# EasyEDA Pro project ir2104_V1.2.eprj

# Schematic IR2104
Create Date: 2023-09-25; Page Name: P1; Project Name: 主控板_V1; Schematic Name: Schematic1; Update Date: 2023-09-26; Company: 嘉立创EDA; Page Size: A4; Version: V1.0
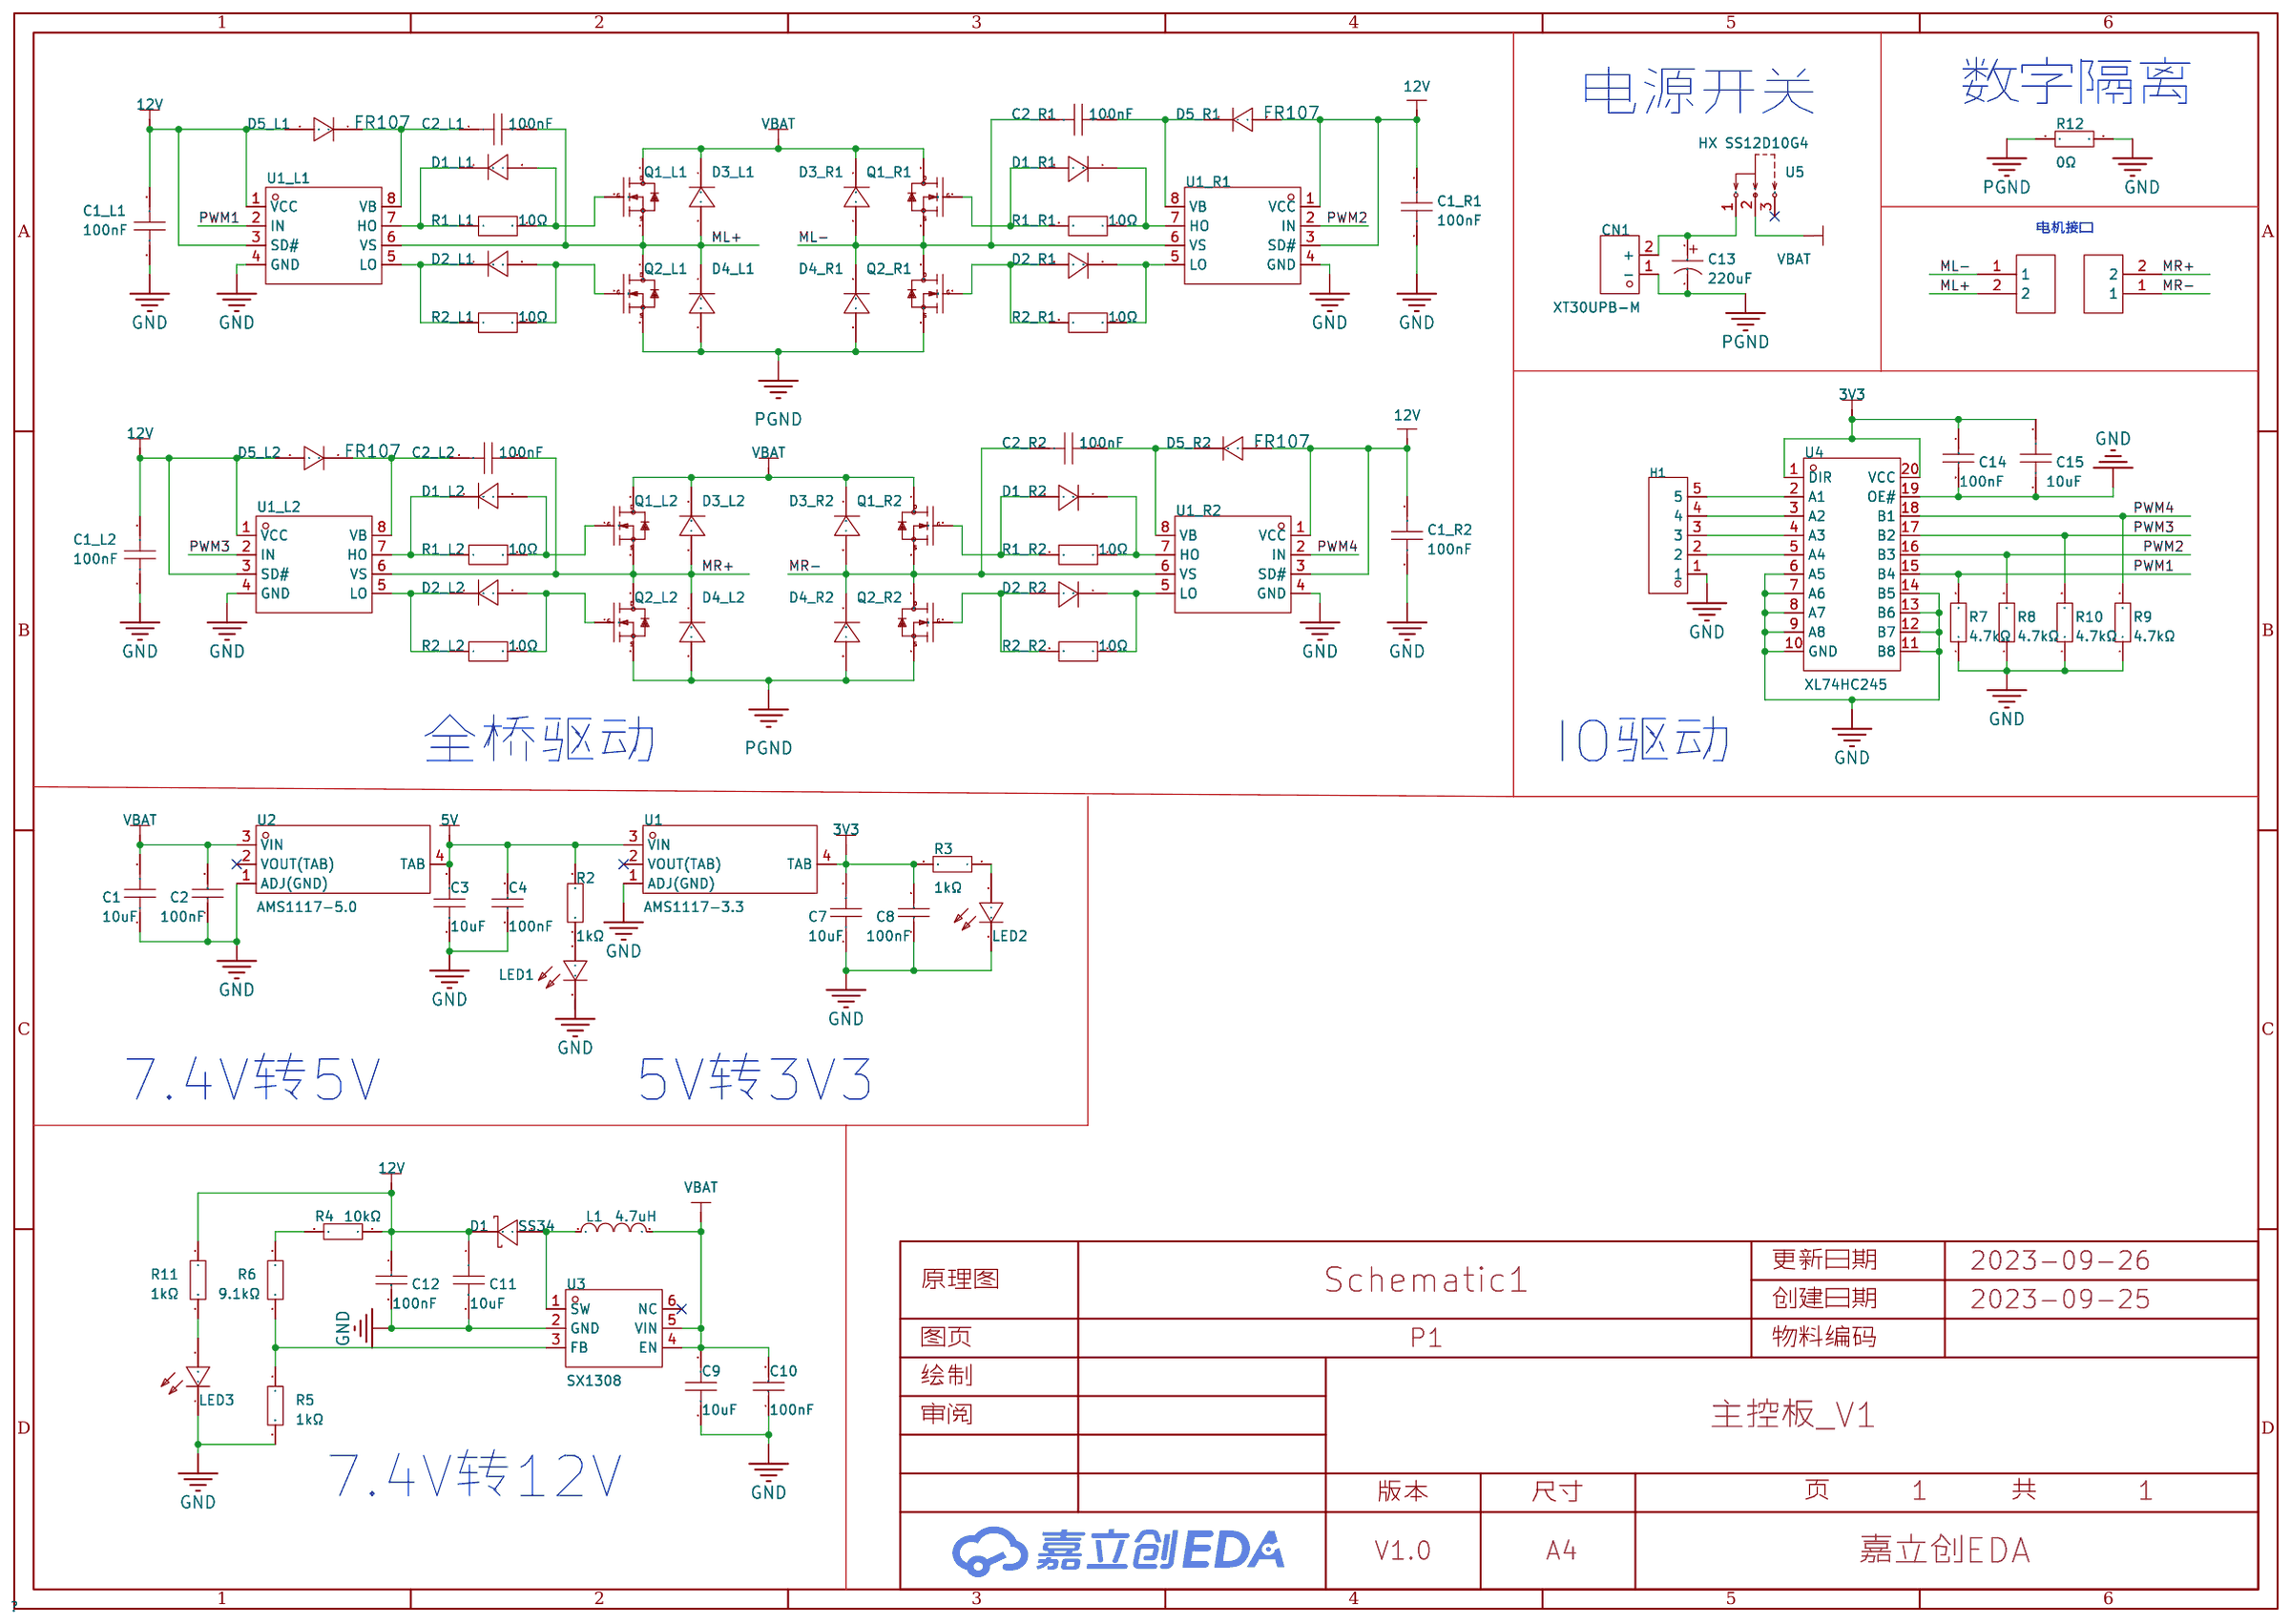
[diagram p0: schematic sheet]

## Parts
C1  10uF  [C0603]
C1_L1  100nF  [C0603]
C1_L2  100nF  [C0603]
C1_R1  100nF  [C0603]
C1_R2  100nF  [C0603]
C2  100nF  [C0603]
C2_L1  100nF  [C0603]
C2_L2  100nF  [C0603]
C2_R1  100nF  [C0603]
C2_R2  100nF  [C0603]
C3  10uF  [C0603]
C4  100nF  [C0603]
C7  10uF  [C0603]
C8  100nF  [C0603]
C9  10uF  [C0603]
C10  100nF  [C0603]
C11  10uF  [C0603]
C12  100nF  [C0603]
C13  220uF  [CAP-TH_BD8.0-P3.50-D0.6-FD]
C14  100nF  [C0603]
C15  10uF  [C0603]
CN1  XT30UPB-M  [CONN-TH_XT30UPB-M]
D1  SS34  [SMA_L4.3-W2.6-LS5.2-RD]
D1_L1  US1M  [SMA_L4.4-W2.8-LS5.4-RD]
D1_L2  US1M  [SMA_L4.4-W2.8-LS5.4-RD]
D1_R1  US1M  [SMA_L4.4-W2.8-LS5.4-RD]
D1_R2  US1M  [SMA_L4.4-W2.8-LS5.4-RD]
D2_L1  US1M  [SMA_L4.4-W2.8-LS5.4-RD]
D2_L2  US1M  [SMA_L4.4-W2.8-LS5.4-RD]
D2_R1  US1M  [SMA_L4.4-W2.8-LS5.4-RD]
D2_R2  US1M  [SMA_L4.4-W2.8-LS5.4-RD]
D3_L1  US1M  [SMA_L4.4-W2.8-LS5.4-RD]
D3_L2  US1M  [SMA_L4.4-W2.8-LS5.4-RD]
D3_R1  US1M  [SMA_L4.4-W2.8-LS5.4-RD]
D3_R2  US1M  [SMA_L4.4-W2.8-LS5.4-RD]
D4_L1  US1M  [SMA_L4.4-W2.8-LS5.4-RD]
D4_L2  US1M  [SMA_L4.4-W2.8-LS5.4-RD]
D4_R1  US1M  [SMA_L4.4-W2.8-LS5.4-RD]
D4_R2  US1M  [SMA_L4.4-W2.8-LS5.4-RD]
D5_L1  FR107  [SOD-123_L2.8-W1.8-LS3.7-RD]
D5_L2  FR107  [SOD-123_L2.8-W1.8-LS3.7-RD]
D5_R1  FR107  [SOD-123_L2.8-W1.8-LS3.7-RD]
D5_R2  FR107  [SOD-123_L2.8-W1.8-LS3.7-RD]
H1  PZ254V-11-05P  [HDR-TH_5P-P2.54-V-M]
L1  4.7uH  [IND-SMD_L5.4-W5.2_FXL0530]
LED1  NCD0603R1  [LED0603-RD_RED]
LED2  NCD0603R1  [LED0603-RD_RED]
LED3  NCD0603R1  [LED0603-RD_RED]
P1  WJ500V-5.08-2P  [CONN-TH_2P-P5.00_WJ500V-5.08-2P]
P2  WJ500V-5.08-2P  [CONN-TH_2P-P5.00_WJ500V-5.08-2P]
Q1_L1  IRFR3607TRPBF  [TO-252-3_L6.5-W5.8-P4.58-BL]
Q1_L2  IRFR3607TRPBF  [TO-252-3_L6.5-W5.8-P4.58-BL]
Q1_R1  IRFR3607TRPBF  [TO-252-3_L6.5-W5.8-P4.58-BL]
Q1_R2  IRFR3607TRPBF  [TO-252-3_L6.5-W5.8-P4.58-BL]
Q2_L1  IRFR3607TRPBF  [TO-252-3_L6.5-W5.8-P4.58-BL]
Q2_L2  IRFR3607TRPBF  [TO-252-3_L6.5-W5.8-P4.58-BL]
Q2_R1  IRFR3607TRPBF  [TO-252-3_L6.5-W5.8-P4.58-BL]
Q2_R2  IRFR3607TRPBF  [TO-252-3_L6.5-W5.8-P4.58-BL]
R1_L1  10Ω  [R0603]
R1_L2  10Ω  [R0603]
R1_R1  10Ω  [R0603]
R1_R2  10Ω  [R0603]
R2  1kΩ  [R0603]
R2_L1  10Ω  [R0603]
R2_L2  10Ω  [R0603]
R2_R1  10Ω  [R0603]
R2_R2  10Ω  [R0603]
R3  1kΩ  [R0603]
R4  10kΩ  [R0603]
R5  1kΩ  [R0603]
R6  9.1kΩ  [R0603]
R7  4.7kΩ  [R0603]
R8  4.7kΩ  [R0603]
R9  4.7kΩ  [R0603]
R10  4.7kΩ  [R0603]
R11  1kΩ  [R0603]
R12  0Ω  [R0805]
U1  AMS1117-3.3  [SOT-223-4_L6.5-W3.5-P2.30-LS7.0-BR]
U1_L1  EG2104  [SOP-8_L5.0-W4.0-P1.27-LS6.2-BL]
U1_L2  EG2104  [SOP-8_L5.0-W4.0-P1.27-LS6.2-BL]
U1_R1  EG2104  [SOP-8_L5.0-W4.0-P1.27-LS6.2-BL]
U1_R2  EG2104  [SOP-8_L5.0-W4.0-P1.27-LS6.2-BL]
U2  AMS1117-5.0  [SOT-223_L6.7-W3.5-P2.30-BR]
U3  SX1308  [SOT-23-6_L2.9-W1.6-P0.95-LS2.8-BL]
U4  XL74HC245  [SOP-20_L12.8-W7.5-P1.27-LS10.4-BL]
U5  HX SS12D10G4  [SW-TH_SHOU-HAN_SS12D10G4]

## Library data of the parts
C1 C3 C7 C9 C11 C15 = CL10A106MA8NRNC: 容值:10uF;精度:±20%;额定电压:25V;材质(温度系数):X5R;; LCSC Part Name: 10uF ±20% 25V; Supplier Part: C96446; Manufacturer: SAMSUNG(三星); Supplier Footprint: 0603; JLCPCB Part Class: Basic Part; Datasheet: https://atta.szlcsc.com/upload/public/pdf/source/20170325/1490427913016.pdf; Supplier: LCSC; Tolerance: ±20%; Voltage Rated: 25V; Temperature Coefficient: X5R
C1_L1 C1_L2 C1_R1 C1_R2 C2_L1 C2_L2 C2_R1 C2_R2 = CL10B104KB8NNNC: 容值:100nF;精度:±10%;额定电压:50V;材质(温度系数):X7R;; LCSC Part Name: 100nF±10%50V; Supplier Part: C1591; Manufacturer: SAMSUNG(三星); Supplier Footprint: 0603; JLCPCB Part Class: 扩展库; Datasheet: https://atta.szlcsc.com/upload/public/pdf/source/20160103/1457707680512.pdf; Supplier: LCSC; Tolerance: ±10%; Voltage Rated: 50V; Temperature Coefficient: X7R
C2 C4 C8 C10 C12 C14 = 0603B104K500NT: 容值:100nF;精度:±10%;额定电压:50V;材质(温度系数):X7R;; LCSC Part Name: 100nF ±10% 50V; Supplier Part: C30926; Manufacturer: FH(风华); Supplier Footprint: 0603; JLCPCB Part Class: Extended Part; Datasheet: https://atta.szlcsc.com/upload/public/pdf/source/20170923/C30926_1506149436298988724.pdf; Supplier: LCSC; Tolerance: ±10%; Voltage Rated: 50V; Temperature Coefficient: X7R
C13 = KM227M035F12RR0VH2FP0: 容值:220uF;精度:±20%;额定电压:35V;纹波电流:-;等效串联电阻:-;; LCSC Part Name: 220uF ±20% 35V; Supplier Part: C2063; Manufacturer: CX(承兴); Supplier Footprint: 插件,D8xL12mm; JLCPCB Part Class: Extended Part; Datasheet: https://atta.szlcsc.com/upload/public/pdf/source/20211027/06D6BA3719C264B639DC286D935D03EA.pdf; Supplier: LCSC; Tolerance: ±20%; Rated Voltage: 35V; φD: 8mm; L: 12mm; Lead Spacing: 3.5mm; Lifetime @ Temp: 2000hrs@105℃
CN1 = XT30UPB-M: LCSC Part Name: AMASS(艾迈斯)板载立式 航模锂电池控制器连接器插头 公头XT30UPB-M; Supplier Part: C428721; Manufacturer: AMASS(艾迈斯); JLCPCB Part Class: Extended Part; Datasheet: https://atta.szlcsc.com/upload/public/pdf/source/20230412/7B5DFEF57C9EA5273853390C734B3AC5.pdf; Supplier: LCSC
D1 = SS34_C8678: 二极管配置:独立式;直流反向耐压(Vr):40V;平均整流电流(Io):3A;正向压降(Vf):550mV@3A;; LCSC Part Name: 40V 3A 550mV@3A; Supplier Part: C8678; Manufacturer: MDD; Supplier Footprint: SMA(DO-214AC); JLCPCB Part Class: Basic Part; Datasheet: https://atta.szlcsc.com/upload/public/pdf/source/20230314/A80AE34493C69B89E2F4B1712F433538.pdf; Supplier: LCSC; Diode Configuration: 独立式; Reverse Voltage (Vr): 40V; Average Rectified Current (Io): 3A; Forward Voltage (Vf@If): 550mV@3A; Reverse Leakage Current (Ir): 500uA@40V
D1_L1 D1_L2 D1_R1 D1_R2 D2_L1 D2_L2 D2_R1 D2_R2 D3_L1 D3_L2 D3_R1 D3_R2 D4_L1 D4_L2 D4_R1 D4_R2 = US1M_C412437: 二极管配置:独立式;直流反向耐压(Vr):1kV;平均整流电流(Io):1A;正向压降(Vf):1.7V@1A;反向电流(Ir):5uA@1kV;反向恢复时间(trr):75ns;工作温度:-50℃~+150℃@(Tj);; LCSC Part Name: 1kV1A75ns; Supplier Part: C412437; Manufacturer: MDD; Supplier Footprint: SMA; JLCPCB Part Class: BasicPart; Datasheet: https://atta.szlcsc.com/upload/public/pdf/source/20200710/C412437_A2B0E4A2AF6F53946A2ACCD8257B288E.pdf; Supplier: LCSC; Diode Configuration: 独立式; Reverse Voltage (Vr): 1kV; Average Rectified Current (Io): 1A; Forward Voltage (Vf@If): 1.7V@1A; Reverse Leakage Current: 5uA@1kV; Reverse Recovery Time (trr): 75ns; Operating Temperature: -50℃~+150℃@(Tj)
D5_L1 D5_L2 D5_R1 D5_R2 = FR107_C511885: 二极管配置:-;直流反向耐压(Vr):1kV;平均整流电流(Io):1A;正向压降(Vf):1.3V@1A;反向电流(Ir):5uA@1kV;反向恢复时间(trr):500ns;工作温度:-55℃~+150℃@(Tj);; LCSC Part Name: 1kV1A500ns; Supplier Part: C511885; Manufacturer: BORN(伯恩半导体); Supplier Footprint: SOD-123; JLCPCB Part Class: 扩展库; Datasheet: https://atta.szlcsc.com/upload/public/pdf/source/20200413/C511885_F5BBF7A87475723E74BE0D118A106A7A.pdf; Supplier: LCSC; Reverse Voltage (Vr): 1kV; Average Rectified Current (Io): 1A; Forward Voltage (Vf@If): 1.3V@1A; Reverse Leakage Current: 5uA@1kV; Reverse Recovery Time (trr): 500ns; Operating Temperature: -55℃~+150℃@(Tj)
H1 = PZ254V-11-05P: 排数:单排;总PIN位数:5P;间距:2.54mm;插针结构:1x5P;行距:-;安装类型:直插;圆针/方针:方针;额定电流:-;额定电压:-;配合针长度:6mm;塑高:2.5mm;端接针长度:3mm;触头材质:黄铜;触头镀层:-;工作温度范围:-40℃~+105℃;颜色:黑色;; LCSC Part Name: 2.54mm 1x5P 直插 方针; Supplier Part: C492404; Manufacturer: XFCN(兴飞); Supplier Footprint: 插件,P=2.54mm; JLCPCB Part Class: Extended Part; Datasheet: https://atta.szlcsc.com/upload/public/pdf/source/20200309/C492404_E51533260F8710EFF5D4617281164C1D.pdf; Supplier: LCSC; Number of Rows: 单排; Number of Pins: 5P; Pitch: 2.54mm; Pin Structure: 1x5P; Mounting Type: 直插; Circluar Pins/Square Pins: 方针; Length of Mating Pin: 6mm; Insulation Height: 2.5mm; Length of End Connection Pin: 3mm; Contact Material: 黄铜; Operating Temperature Range: -40℃~+105℃; Color: 黑色
L1 = FXL0530-4R7-M: 电感值:4.7uH;精度:±20%;额定电流:4.5A;饱和电流(Isat):5A;; LCSC Part Name: 4.7uH ±20% 4.5A 50mΩ; Supplier Part: C177246; Manufacturer: cjiang(长江微电); Supplier Footprint: SMD,5.2x5.4mm; JLCPCB Part Class: 扩展库; Datasheet: https://atta.szlcsc.com/upload/public/pdf/source/20190322/C177246_D81D0671B72FD9DE4B58607F480A6AE0.pdf; Supplier: LCSC; Tolerance: ±20%; Rated Current: 4.5A; Saturation Current (Isat): 5A; DC Resistance (DCR): 50mΩ
LED1-LED3 = NCD0603R1_C84263: 发光颜色:红灯;; LCSC Part Name: 红灯; Supplier Part: C84263; Manufacturer: 国星光电; Supplier Footprint: 0603; JLCPCB Part Class: Extended Part; Datasheet: https://atta.szlcsc.com/upload/public/pdf/source/20200820/C84263_DABC6A75E58F576973B407FDBA283D60.pdf; Supplier: LCSC; Emitted Color: 红灯
P1 P2 = WJ500V-5.08-2P: 间距:5.08mm;结构:1x2P;排数:1;每排PIN数:2;安装方式:直针;额定电流:18A;额定电压:250V;线规 - AWG:14~30;线规 - mm2:2.5;工作温度范围:-40℃~+105℃;颜色:绿色;; LCSC Part Name: 5.08mm 1x2P 排数:1 每排P数:2 直针 可拼接; Supplier Part: C8465; Manufacturer: KANGNEX(康奈克斯电气); Supplier Footprint: 插件,P=5.08mm; JLCPCB Part Class: 扩展库; Datasheet: https://atta.szlcsc.com/upload/public/pdf/source/20191225/C8465_02D34CE5B5B4A53DF5891601D97FA9F4.pdf; Supplier: LCSC; Pitch: 5.08mm; Structure: 1x2P; Number of Rows: 1; Number of PINs Per Row: 2; Mounting Style: 直针; Current Rating (Max): 18A; Voltage Rating (Max): 250V; Wire Gauge - AWG: 14~30; Wire Gauge - mm2: 2.5; Operating Temperature Range: -40℃~+105℃; Color: 绿色
Q1_L1 Q1_L2 Q1_R1 Q1_R2 Q2_L1 Q2_L2 Q2_R1 Q2_R2 = IRFR3607TRPBF: 类型:N沟道;漏源电压(Vdss):75V;连续漏极电流(Id):56A;功率(Pd):140W;导通电阻(RDS(on)@Vgs,Id):9mΩ@10V,46A;阈值电压(Vgs(th)@Id):4V@100uA;; LCSC Part Name: N沟道75V56A; Supplier Part: C74775; Manufacturer: Infineon(英飞凌); Supplier Footprint: TO-252-2(DPAK); JLCPCB Part Class: 扩展库; Datasheet: https://atta.szlcsc.com/upload/public/pdf/source/20180125/C74775_15168616818461301901.pdf; Supplier: LCSC; Type: N沟道; Drain Source Voltage (Vdss): 75V; Continuous Drain Current (Id): 56A; Power Dissipation (Pd): 140W; Drain Source On Resistance (RDS(on)@Vgs,Id): 9mΩ@10V,46A; Gate Threshold Voltage (Vgs(th)@Id): 4V@100uA
R1_L1 R1_L2 R1_R1 R1_R2 R2_L1 R2_L2 R2_R1 R2_R2 = ERJUP3D10R0V: 阻值:10Ω;精度:±0.5%;功率:250mW;; LCSC Part Name: 10Ω±0.5%250mW; Supplier Part: C491216; Manufacturer: PANASONIC(松下); Supplier Footprint: 0603; JLCPCB Part Class: 扩展库; Datasheet: https://atta.szlcsc.com/upload/public/pdf/source/20200407/C491216_2E39EC09AE614A2EE2B1246D53854D38.pdf; Supplier: LCSC; Tolerance: ±0.5%; Power(Watts): 250mW
R2 R3 R11 = 0603WAF1001T5E: 电阻类型:厚膜电阻;阻值:1kΩ;精度:±1%;功率:100mW;; LCSC Part Name: 1kΩ ±1% 100mW; Supplier Part: C21190; Manufacturer: UNI-ROYAL(厚声); Supplier Footprint: 0603; JLCPCB Part Class: Basic Part; Datasheet: https://atta.szlcsc.com/upload/public/pdf/source/20200306/C422600_1E6D84923E4A46A82E41ADD87F860B5C.pdf; Supplier: LCSC; Type: 厚膜电阻; Tolerance: ±1%; Power(Watts): 100mW; Temperature Coefficient: ±100ppm/℃; Overload Voltage (Max): 75V; Operating Temperature Range: -55℃~+155℃
R4 = RT0603BRD0710KL: 电阻类型:薄膜电阻;阻值:10kΩ;精度:±0.1%;功率:100mW;; LCSC Part Name: 10kΩ ±0.1% 100mW; Supplier Part: C95204; Manufacturer: YAGEO(国巨); Supplier Footprint: 0603; JLCPCB Part Class: Extended Part; Datasheet: https://atta.szlcsc.com/upload/public/pdf/source/20170217/1487301593756.pdf; Supplier: LCSC; Type: 薄膜电阻; Tolerance: ±0.1%; Power(Watts): 100mW; Temperature Coefficient: ±25ppm/℃; Overload Voltage (Max): 75V; Operating Temperature Range: -55℃~+155℃
R5 = RT0603BRD071KL: 电阻类型:薄膜电阻;阻值:1kΩ;精度:±0.1%;功率:100mW;; LCSC Part Name: 1kΩ ±0.1% 100mW; Supplier Part: C110776; Manufacturer: YAGEO(国巨); Supplier Footprint: 0603; JLCPCB Part Class: Extended Part; Datasheet: https://atta.szlcsc.com/upload/public/pdf/source/20170704/1499151282044.pdf; Supplier: LCSC; Type: 薄膜电阻; Tolerance: ±0.1%; Power(Watts): 100mW; Temperature Coefficient: ±25ppm/℃; Overload Voltage (Max): 75V; Operating Temperature Range: -55℃~+155℃
R6 = PTFR0603B9K10P9: 电阻类型:薄膜电阻;阻值:9.1kΩ;精度:±0.1%;功率:100mW;; LCSC Part Name: 9.1kΩ ±0.1% 100mW; Supplier Part: C351620; Manufacturer: RESI(开步睿思）; Supplier Footprint: 0603; JLCPCB Part Class: Extended Part; Datasheet: https://atta.szlcsc.com/upload/public/pdf/source/20200421/C328426_1F8A6F869BB4A34F9E140D3E05CCCC70.pdf; Supplier: LCSC; Type: 薄膜电阻; Tolerance: ±0.1%; Power(Watts): 100mW; Temperature Coefficient: ±25ppm/℃; Overload Voltage (Max): 100V; Operating Temperature Range: -55℃~+125℃
R7-R10 = 0603WAF4701T5E: 电阻类型:厚膜电阻;阻值:4.7kΩ;精度:±1%;功率:100mW;; LCSC Part Name: 4.7kΩ ±1% 100mW; Supplier Part: C23162; Manufacturer: UNI-ROYAL(厚声); Supplier Footprint: 0603; JLCPCB Part Class: Basic Part; Datasheet: https://atta.szlcsc.com/upload/public/pdf/source/20200306/C422600_1E6D84923E4A46A82E41ADD87F860B5C.pdf; Supplier: LCSC; Type: 厚膜电阻; Tolerance: ±1%; Power(Watts): 100mW; Temperature Coefficient: ±100ppm/℃; Overload Voltage (Max): 75V; Operating Temperature Range: -55℃~+155℃
R12 = 0805W8F0000T5E: 电阻类型:厚膜电阻;阻值:0Ω;精度:±1%;功率:125mW;; LCSC Part Name: 0Ω ±1% 125mW; Supplier Part: C17477; Manufacturer: UNI-ROYAL(厚声); Supplier Footprint: 0805; JLCPCB Part Class: Basic Part; Datasheet: https://atta.szlcsc.com/upload/public/pdf/source/20200306/C422600_1E6D84923E4A46A82E41ADD87F860B5C.pdf; Supplier: LCSC; Type: 厚膜电阻; Tolerance: ±1%; Power(Watts): 125mW; Temperature Coefficient: ±800ppm/℃; Overload Voltage (Max): 150V; Operating Temperature Range: -55℃~+155℃
U1 = AMS1117-3.3_C347222: 输出类型:固定;输出极性:正;最大输入电压:18V;输出电压:3.3V;输出电流:1A;电源纹波抑制比(PSRR):60dB@(120Hz);; Supplier Part: C347222; Manufacturer: UMW(广东友台半导体); Supplier Footprint: SOT-223; JLCPCB Part Class: Extended Part; Datasheet: https://atta.szlcsc.com/upload/public/pdf/source/20211011/50CC665C22E3A66C08379A4A74BDA25C.pdf; Supplier: LCSC; Output Type: 固定; Output Polarity: 正; Number of Outputs: 1; Maximum Input Voltage: 18V; Output Voltage: 3.3V; Dropout Voltage: 1.3V@(1A); Output Current: 1A; Power Supply Rejection Ratio (PSRR): 60dB@(120Hz)
U1_L1 U1_L2 U1_R1 U1_R2 = EG2104: 高性价比,600V，半桥式Nmos预驱动器; Supplier Part: C186697; Manufacturer: EG(屹晶微); Supplier Footprint: SOP-8-150mil; JLCPCB Part Class: 扩展库; Datasheet: https://atta.szlcsc.com/upload/public/pdf/source/20220627/4CCFA0CAB664067FEE4AF87E4129127F.pdf; Supplier: LCSC
U2 = AMS1117-5.0_C347223: 输出类型:固定;输出极性:正;最大输入电压:18V;输出电压:5V;输出电流:1A;电源纹波抑制比(PSRR):60dB@(120Hz);; LCSC Part Name: 输入18V 输出5V 1A; Supplier Part: C347223; Manufacturer: UMW(广东友台半导体); Supplier Footprint: SOT-223; JLCPCB Part Class: Extended Part; Datasheet: https://atta.szlcsc.com/upload/public/pdf/source/20211011/50CC665C22E3A66C08379A4A74BDA25C.pdf; Supplier: LCSC; Output Type: 固定; Output Polarity: 正; Number of Outputs: 1; Maximum Input Voltage: 18V; Output Voltage: 5V; Dropout Voltage: 1.3V@(1A); Output Current: 1A; Power Supply Rejection Ratio (PSRR): 60dB@(120Hz)
U3 = SX1308: 功能类型:升压型;同步整流:否;输出通道数:1;拓扑结构:升压式;输入电压:2V~24V;输出电压:28V;输出电流(最大值):-;开关频率:1.2MHz;; LCSC Part Name: 升压型 Vin=2V~24V Vout=28V; Supplier Part: C78162; Manufacturer: SX(硕芯科技); Supplier Footprint: SOT-23-6; JLCPCB Part Class: Extended Part; Datasheet: https://atta.szlcsc.com/upload/public/pdf/source/20160920/1474356679185.pdf; Supplier: LCSC; Function: 升压型; Synchronous Rectification: 否; Number of Outputs: 1; Topology: 升压式; Input Voltage: 2V~24V; Output Voltage: 28V; Switching Frequency: 1.2MHz
U4 = XL74HC245: 八路总线收发器; LCSC Part Name: 总线收发器; Supplier Part: C561304; Manufacturer: XINLUDA(信路达); Supplier Footprint: SOP-20; JLCPCB Part Class: Extended Part; Datasheet: https://atta.szlcsc.com/upload/public/pdf/source/20200529/C561304_A214D245EEE9B91D1EB7AEB54AB3B76F.pdf; Supplier: LCSC
U5 = HX SS12D10G4: LCSC Part Name: 拨动开关 立式两档拨动,单排3脚插件,12.7x6.7x6.4,黑柄4mm; Supplier Part: C5149841; Manufacturer: hanxia(韩下); Supplier Footprint: 插件; JLCPCB Part Class: 扩展库; Datasheet: https://atta.szlcsc.com/upload/public/pdf/source/20220907/2020D7183ED16DD6E2B9F5A13FB144CF.pdf; Supplier: LCSC

## Nets
3V3: C7.2 C8.2 C14.1 C15.1 R3.2 U1.4(TAB) U4.1(DIR) U4.20(VCC)
5V: C3.2 C4.2 R2.1 U1.3(VIN) U2.4(TAB)
12V: C1_L1.2 C1_L2.2 C1_R1.2 C1_R2.2 C11.1 C12.1 D1.1(K) D5_L1.2(A) D5_L2.2(A) D5_R1.2(A) D5_R2.2(A) R4.1 R11.1 U1_L1.1(VCC) U1_L1.3(SD#) U1_L2.1(VCC) U1_L2.3(SD#) U1_R1.1(VCC) U1_R1.3(SD#) U1_R2.1(VCC) U1_R2.3(SD#)
GND: C1.1 C1_L1.1 C1_L2.1 C1_R1.1 C1_R2.1 C2.1 C3.1 C4.1 C7.1 C8.1 C9.1 C10.1 C11.2 C12.2 C14.2 C15.2 H1.1 LED1.1(K) LED2.1(K) LED3.1(K) R5.2 R7.1 R8.1 R9.1 R10.1 R12.2 U1.1(ADJ(GND)) U1_L1.4(GND) U1_L2.4(GND) U1_R1.4(GND) U1_R2.4(GND) U2.1(ADJ(GND)) U3.2(GND) U4.6(A5) U4.7(A6) U4.8(A7) U4.9(A8) U4.10(GND) U4.11(B8) U4.12(B7) U4.13(B6) U4.14(B5) U4.19(OE#)
PGND: C13.2 CN1.1(-) D4_L1.2(A) D4_L2.2(A) D4_R1.2(A) D4_R2.2(A) Q2_L1.3(S) Q2_L2.3(S) Q2_R1.3(S) Q2_R2.3(S) R12.1
VBAT: C1.2 C2.2 C9.2 C10.2 D3_L1.1(C) D3_L2.1(C) D3_R1.1(C) D3_R2.1(C) L1.2 Q1_L1.2(D) Q1_L2.2(D) Q1_R1.2(D) Q1_R2.2(D) U2.3(VIN) U3.4(EN) U3.5(VIN) U5.2
ML+: C2_L1.2 D3_L1.2(A) D4_L1.1(C) P1.2 Q1_L1.3(S) Q2_L1.2(D) U1_L1.6(VS)
ML-: C2_R1.2 D3_R1.2(A) D4_R1.1(C) P1.1 Q1_R1.3(S) Q2_R1.2(D) U1_R1.6(VS)
MR+: C2_L2.2 D3_L2.2(A) D4_L2.1(C) P2.2 Q1_L2.3(S) Q2_L2.2(D) U1_L2.6(VS)
MR-: C2_R2.2 D3_R2.2(A) D4_R2.1(C) P2.1 Q1_R2.3(S) Q2_R2.2(D) U1_R2.6(VS)
PWM1: R7.2 U1_L1.2(IN) U4.15(B4)
PWM2: R8.2 U1_R1.2(IN) U4.16(B3)
PWM3: R10.2 U1_L2.2(IN) U4.17(B2)
PWM4: R9.2 U1_R2.2(IN) U4.18(B1)
$1N995: D2_L1.2(A) Q2_L1.1(G) R2_L1.2
$1N997: D2_L1.1(C) R2_L1.1 U1_L1.5(LO)
$1N1006: D1_R1.1(C) R1_R1.1 U1_R1.7(HO)
$1N1007: D1_R1.2(A) Q1_R1.1(G) R1_R1.2
$1N1008: D2_R1.1(C) R2_R1.1 U1_R1.5(LO)
$1N1009: D2_R1.2(A) Q2_R1.1(G) R2_R1.2
$1N2169: D2_L2.2(A) Q2_L2.1(G) R2_L2.2
$1N2170: D1_L2.1(C) R1_L2.1 U1_L2.7(HO)
$1N2171: D2_L2.1(C) R2_L2.1 U1_L2.5(LO)
$1N2190: D1_R2.1(C) R1_R2.1 U1_R2.7(HO)
$1N2191: D1_R2.2(A) Q1_R2.1(G) R1_R2.2
$1N2192: D2_R2.1(C) R2_R2.1 U1_R2.5(LO)
$1N2193: D2_R2.2(A) Q2_R2.1(G) R2_R2.2
$1N2213: D1_L2.2(A) Q1_L2.1(G) R1_L2.2
$1N3245: D1.2(A) L1.1 U3.1(SW)
$1N4108: C13.1 CN1.2(+) U5.1
$1N4523: H1.2 U4.5(A4)
$1N4524: H1.3 U4.4(A3)
$1N4525: H1.4 U4.3(A2)
$1N4526: H1.5 U4.2(A1)
Net-(C2_L1-1): C2_L1.1 D5_L1.1(K) U1_L1.8(VB)
Net-(C2_L2-1): C2_L2.1 D5_L2.1(K) U1_L2.8(VB)
Net-(C2_R1-1): C2_R1.1 D5_R1.1(K) U1_R1.8(VB)
Net-(C2_R2-1): C2_R2.1 D5_R2.1(K) U1_R2.8(VB)
Net-(D1_L1-1): D1_L1.1(C) R1_L1.1 U1_L1.7(HO)
Net-(D1_L1-2): D1_L1.2(A) Q1_L1.1(G) R1_L1.2
Net-(LED1-2): LED1.2(A) R2.2
Net-(LED2-2): LED2.2(A) R3.1
Net-(LED3-2): LED3.2(A) R11.2
Net-(R4-2): R4.2 R6.2
Net-(R5-1): R5.1 R6.1 U3.3(FB)

Not connected (* = marked no-connect by the designer): U1 2(VOUT(TAB))*; U2 2(VOUT(TAB))*; U3 6(NC)*; U5 3*

## Notes on the sheet
- 数字隔离
- 电源开关
- 电机接口
- 全桥驱动
- IO驱动
- 7.4V转5V
- 5V转3V3
- 7.4V转12V

# Board IR2104
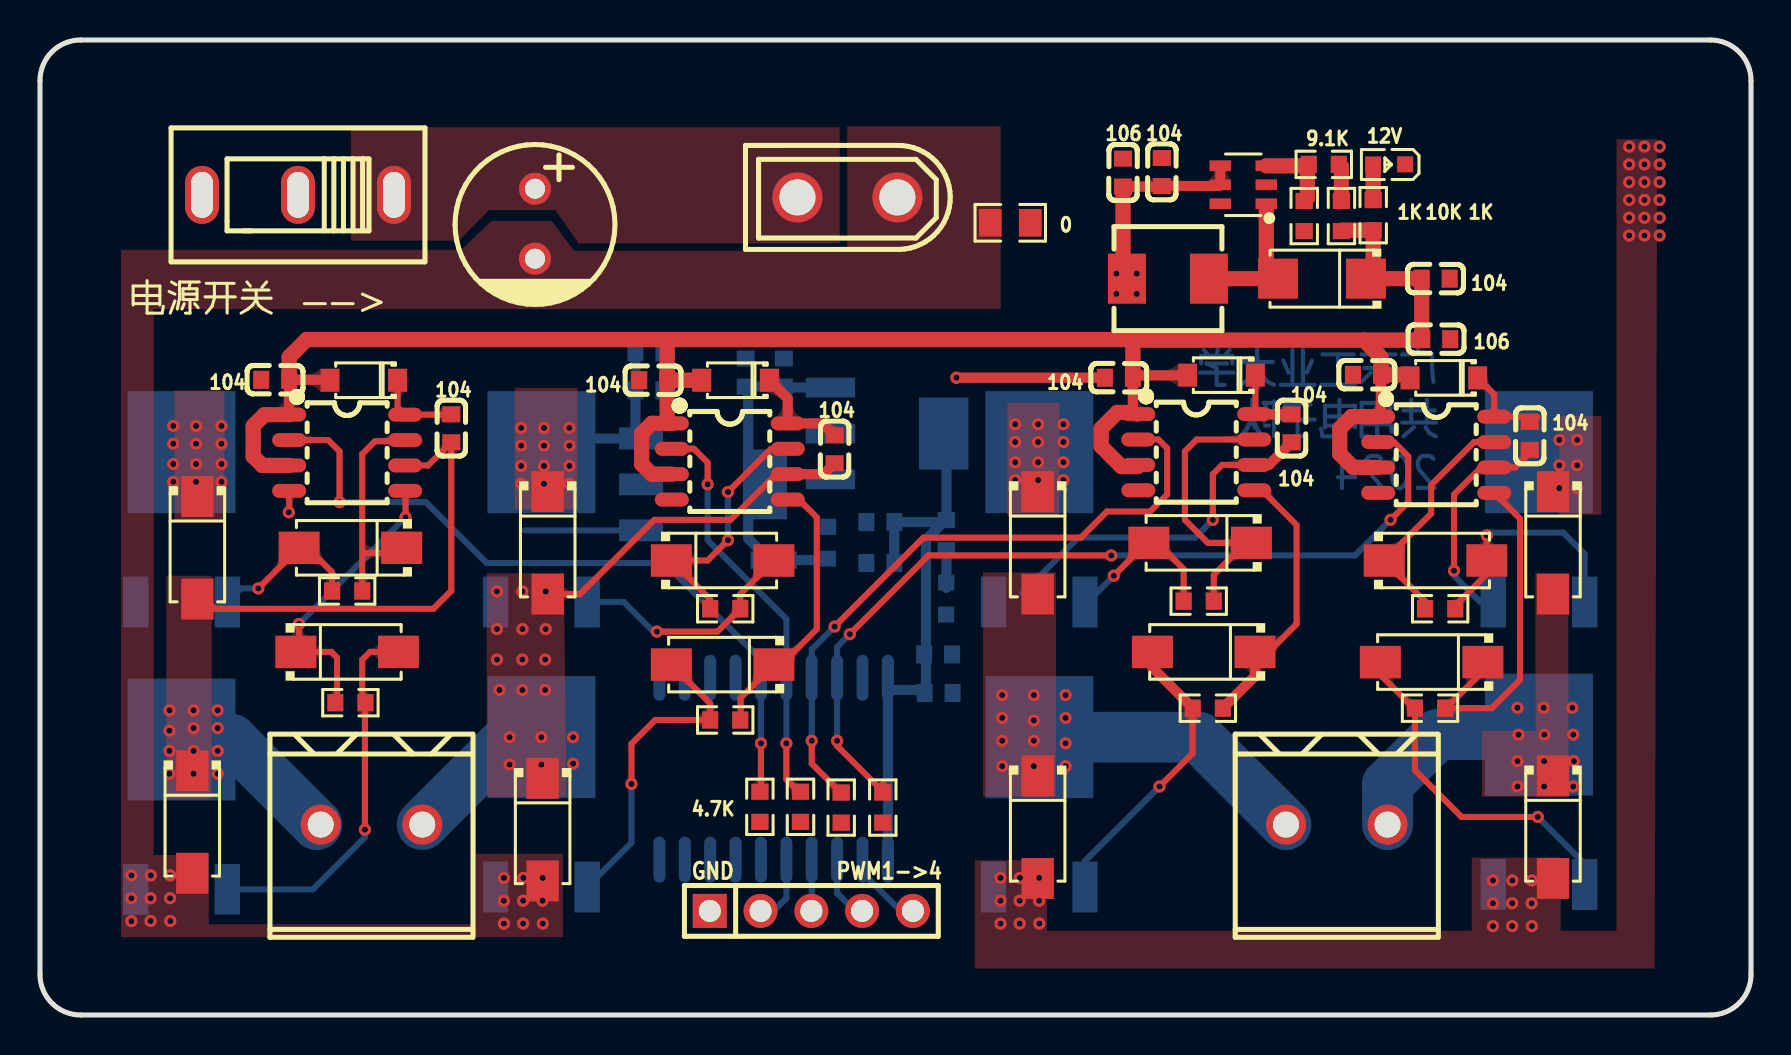
[diagram p1: board, top side]
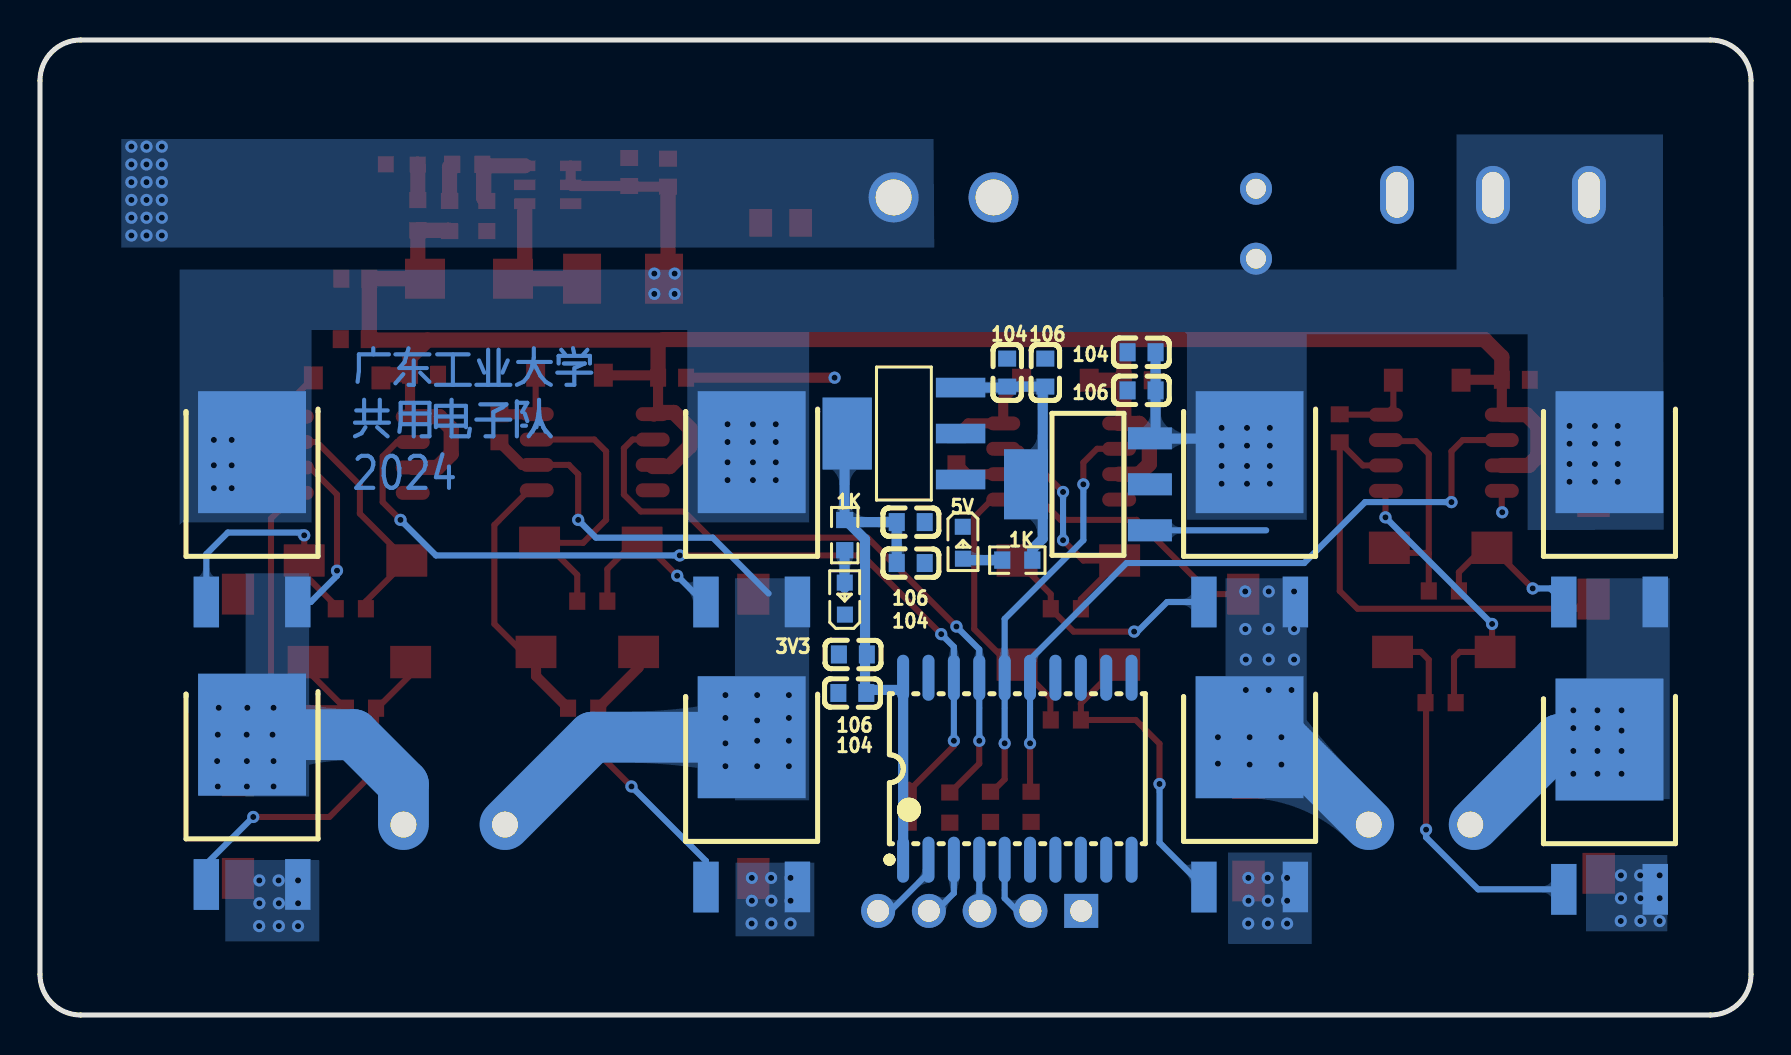
[diagram p2: board, bottom side, seen from below]

Outline 85.6 x 48.77 mm; copper layers: Top Layer, Bottom Layer. Coordinates in mm from the lower left corner of the outline.
Outline path: 0,46.74 0,2.03 arc(0.6,0.6) 2.03,0 83.57,0 arc(85,0.6) 85.6,2.03 85.6,46.74 arc(85,48.17) 83.57,48.77 2.03,48.77 arc(0.6,48.17) 0,46.74
Stack: Top Layer 0.035mm / Dielectric1 1.51mm FR4 er 4.5 / Bottom Layer 0.035mm

## Design rules (mm)
template: 自定义配置
spacing copperThickness1oz (default): track to track 0.102, other pairs 0 to 0.3
spacing copperThickness2oz: track to track 0.203, other pairs 0.152 to 0.3
track width copperThickness1oz (default): min 0.127, default 0.254, max 2.54
track width copperThickness2oz: min 0.203, default 0.254, max 2.54
differential pair differentialPair (default): width min 0.127, default 0.254, max 2.54; gap min 0.152, default 0.152
via viaSize (default): diameter min 0.5, default 0.61, max 10; hole min 0.3, default 0.305, max 6.3

## Placement (name value [footprint] x y rotation side)
0  0Ω  [R0805]  48.54 39.62 0 top
1K  -  [R0603]  63.25 39.96 270 top
1K#2  -  [R0603]  66.7 40.01 90 top
1K#3  -  [R0603]  45.34 24 90 bottom
1K#4  -  [R0603]  36.71 22.75 0 bottom
3V3  NCD0603R1  [LED0603-RD_RED]  45.33 20.83 90 bottom
4.7K  4.7kΩ  [R0603]  36.02 10.41 90 top
5V  NCD0603R1  [LED0603-RD_RED]  39.43 23.62 270 bottom
9.1K  9.1kΩ  [R0603]  64.22 42.55 0 top
10K  10kΩ  [R0603]  65.11 39.96 90 top
12V  NCD0603R1  [LED0603-RD_RED]  67.5 42.55 180 top
104  -  [C0603]  39.75 28.3 270 top
104#2  -  [C0603]  30.68 31.75 0 top
104#3  -  [C0603]  62.61 29.35 270 top
104#4  -  [C0603]  53.98 31.88 0 top
104#5  -  [C0603]  74.53 28.97 270 top
104#6  -  [C0603]  66.38 32.02 0 top
104#7  -  [C0603]  20.57 29.35 270 top
104#8  -  [C0603]  56.12 42.16 270 top
104#9  -  [C0603]  69.82 36.83 0 top
104#10  -  [C0603]  11.77 31.77 0 top
104#11  -  [C0603]  30.49 33.15 180 bottom
104#12  -  [C0603]  37.21 32.13 270 bottom
104#13  -  [C0603]  42.04 22.61 0 bottom
104#14  -  [C0603]  44.96 16.11 0 bottom
106  -  [C0603]  54.18 42.13 270 top
106#2  -  [C0603]  69.85 33.8 0 top
106#3  -  [C0603]  30.49 31.24 180 bottom
106#4  -  [C0603]  35.31 32.13 270 bottom
106#5  -  [C0603]  42.04 24.65 0 bottom
106#6  -  [C0603]  44.93 18.03 0 bottom
C13  220uF  [CAP-TH_BD8.0-P3.50-D0.6-FD]  24.77 39.58 270 top
CN1  XT30UPB-M  [CONN-TH_XT30UPB-M]  40.39 40.89 180 top
D1  SS34  [SMA_L4.3-W2.6-LS5.2-RD]  64.14 36.83 180 top
D1_L1  US1M  [SMA_L4.4-W2.8-LS5.4-RD]  15.53 23.37 180 top
D1_L2  US1M  [SMA_L4.4-W2.8-LS5.4-RD]  58.04 23.62 180 top
D1_R1  US1M  [SMA_L4.4-W2.8-LS5.4-RD]  34.15 22.73 0 top
D1_R2  US1M  [SMA_L4.4-W2.8-LS5.4-RD]  69.81 22.73 0 top
D2_L1  US1M  [SMA_L4.4-W2.8-LS5.4-RD]  15.37 18.16 0 top
D2_L2  US1M  [SMA_L4.4-W2.8-LS5.4-RD]  58.22 18.16 180 top
D2_R1  US1M  [SMA_L4.4-W2.8-LS5.4-RD]  34.15 17.53 180 top
D2_R2  US1M  [SMA_L4.4-W2.8-LS5.4-RD]  69.62 17.65 180 top
D3_L1  US1M  [SMA_L4.4-W2.8-LS5.4-RD]  7.87 23.37 270 top
D3_L2  US1M  [SMA_L4.4-W2.8-LS5.4-RD]  49.91 23.62 270 top
D3_R1  US1M  [SMA_L4.4-W2.8-LS5.4-RD]  25.4 23.62 270 top
D3_R2  US1M  [SMA_L4.4-W2.8-LS5.4-RD]  75.69 23.62 270 top
D4_L1  US1M  [SMA_L4.4-W2.8-LS5.4-RD]  7.62 9.65 270 top
D4_L2  US1M  [SMA_L4.4-W2.8-LS5.4-RD]  49.91 9.4 270 top
D4_R1  US1M  [SMA_L4.4-W2.8-LS5.4-RD]  25.15 9.27 270 top
D4_R2  US1M  [SMA_L4.4-W2.8-LS5.4-RD]  75.69 9.4 270 top
D5_L1  FR107  [SOD-123_L2.8-W1.8-LS3.7-RD]  16.2 31.75 180 top
D5_L2  FR107  [SOD-123_L2.8-W1.8-LS3.7-RD]  59.11 32 180 top
D5_R1  FR107  [SOD-123_L2.8-W1.8-LS3.7-RD]  34.8 31.75 180 top
D5_R2  FR107  [SOD-123_L2.8-W1.8-LS3.7-RD]  70.23 31.87 180 top
H1  PZ254V-11-05P  [HDR-TH_5P-P2.54-V-M]  38.59 5.21 0 top
L1  4.7uH  [IND-SMD_L5.4-W5.2_FXL0530]  56.43 36.83 180 top
NOREF  -  [R0603]  15.37 21.21 180 top
P1  WJ500V-5.08-2P  [CONN-TH_2P-P5.00_WJ500V-5.08-2P]  16.58 9.53 180 top
P2  WJ500V-5.08-2P  [CONN-TH_2P-P5.00_WJ500V-5.08-2P]  64.88 9.53 180 top
Q1_L1  IRFR3607TRPBF  [TO-252-3_L6.5-W5.8-P4.58-BL]  7.08 24.4 180 bottom
Q1_L2  IRFR3607TRPBF  [TO-252-3_L6.5-W5.8-P4.58-BL]  49.99 24.4 180 bottom
Q1_R1  IRFR3607TRPBF  [TO-252-3_L6.5-W5.8-P4.58-BL]  25.08 24.4 180 bottom
Q1_R2  IRFR3607TRPBF  [TO-252-3_L6.5-W5.8-P4.58-BL]  74.99 24.4 180 bottom
Q2_L1  IRFR3607TRPBF  [TO-252-3_L6.5-W5.8-P4.58-BL]  7.08 10.03 180 bottom
Q2_L2  IRFR3607TRPBF  [TO-252-3_L6.5-W5.8-P4.58-BL]  49.99 10.15 180 bottom
Q2_R1  IRFR3607TRPBF  [TO-252-3_L6.5-W5.8-P4.58-BL]  25.08 10.15 180 bottom
Q2_R2  IRFR3607TRPBF  [TO-252-3_L6.5-W5.8-P4.58-BL]  74.99 10.27 180 bottom
R1_L2  10Ω  [R0603]  57.97 20.7 180 top
R1_R1  10Ω  [R0603]  34.28 20.32 0 top
R1_R2  10Ω  [R0603]  70.05 20.32 0 top
R2_L1  10Ω  [R0603]  15.53 15.62 0 top
R2_L2  10Ω  [R0603]  58.42 15.35 180 top
R2_R1  10Ω  [R0603]  34.28 14.76 180 top
R2_R2  10Ω  [R0603]  69.54 15.35 180 top
R8  4.7kΩ  [R0603]  38.05 10.41 90 top
R9  4.7kΩ  [R0603]  42.16 10.38 90 top
R10  4.7kΩ  [R0603]  40.08 10.38 90 top
U1  AMS1117-3.3  [SOT-223-4_L6.5-W3.5-P2.30-LS7.0-BR]  42.38 29.08 180 bottom
U1_L1  EG2104  [SOP-8_L5.0-W4.0-P1.27-LS6.2-BL]  15.37 28.12 270 top
U1_L2  EG2104  [SOP-8_L5.0-W4.0-P1.27-LS6.2-BL]  57.85 28.15 270 top
U1_R1  EG2104  [SOP-8_L5.0-W4.0-P1.27-LS6.2-BL]  34.51 27.69 270 top
U1_R2  EG2104  [SOP-8_L5.0-W4.0-P1.27-LS6.2-BL]  69.85 28.02 270 top
U2  AMS1117-5.0  [SOT-223_L6.7-W3.5-P2.30-BR]  33.17 26.54 180 bottom
U3  SX1308  [SOT-23-6_L2.9-W1.6-P0.95-LS2.8-BL]  60.2 41.53 90 top
U4  XL74HC245  [SOP-20_L12.8-W7.5-P1.27-LS10.4-BL]  36.7 12.32 180 bottom
U5  HX SS12D10G4  [SW-TH_SHOU-HAN_SS12D10G4]  12.91 41.02 180 top

## Footprints (pads in the part's own frame, mm; a bottom-side part is the same pattern mirrored in y, then rotated)
C0603
  rect 0.8x0.9 smd: 1(-0.7,0) 2(0.7,0)
CAP-TH_BD8.0-P3.50-D0.6-FD
  round 1.6 hole 1: 1(-1.75,0) 2(1.75,0)
CONN-TH_2P-P5.00_WJ500V-5.08-2P
  round 2 hole 1.3: 1(-2.54,0) 2(2.54,0)
CONN-TH_XT30UPB-M
  round 2.5 hole 1.8: 1(-2.5,0) 2(2.5,0)
HDR-TH_5P-P2.54-V-M
  rect 1.7x1.7 hole 1.1: 1(-5.08,0)
  round 1.7 hole 1.1: 2(-2.54,0) 3(0,0) 4(2.54,0) 5(5.08,0)
IND-SMD_L5.4-W5.2_FXL0530
  rect 1.9x2.5 smd: 1(-2.05,0) 2(2.05,0)
LED0603-RD_RED
  rect 0.8x0.8 smd: 1(-0.799,-0.004) 2(0.799,0.004)
R0603
  rect 0.806x0.864 smd: 1(-0.753,0) 2(0.753,0)
R0805
  rect 1.133x1.377 smd: 1(-1,0) 2(1,0)
SMA_L4.3-W2.6-LS5.2-RD
  rect 2x2 smd: 1(-2.2,0) 2(2.2,0)
SMA_L4.4-W2.8-LS5.4-RD
  rect 2.046x1.62 smd: 1(-2.566,0) 2(2.566,0)
SOD-123_L2.8-W1.8-LS3.7-RD
  rect 0.95x1.15 smd: 1(-1.692,0) 2(1.692,0)
SOP-8_L5.0-W4.0-P1.27-LS6.2-BL
  oval 0.7x1.7 smd: 1(-1.905,-2.9) 2(-0.635,-2.9) 3(0.635,-2.9) 4(1.905,-2.9) 5(1.905,2.9) 6(0.635,2.9) 7(-0.635,2.9) 8(-1.905,2.9)
SOP-20_L12.8-W7.5-P1.27-LS10.4-BL
  oval 0.6x2.3 smd: 1(-5.715,-4.55) 2(-4.445,-4.55) 3(-3.175,-4.55) 4(-1.905,-4.55) 5(-0.635,-4.55) 6(0.635,-4.55) 7(1.905,-4.55) 8(3.175,-4.55) 9(4.445,-4.55) 10(5.715,-4.55) 11(5.715,4.55) 12(4.445,4.55) 13(3.175,4.55) 14(1.905,4.55) 15(0.635,4.55) 16(-0.635,4.55) 17(-1.905,4.55) 18(-3.175,4.55) 19(-4.445,4.55) 20(-5.715,4.55)
SOT-23-6_L2.9-W1.6-P0.95-LS2.8-BL
  rect 0.532x1.072 smd: 1(-0.95,-1.149) 2(0,-1.149) 3(0.95,-1.149) 4(0.95,1.149) 5(0,1.149) 6(-0.95,1.149)
SOT-223-4_L6.5-W3.5-P2.30-LS7.0-BR
  rect 2.47x0.98 smd: 1(2.835,-2.3) 2(2.835,0) 3(2.835,2.3)
  rect 2.47x3.6 smd: 4(-2.835,0)
SOT-223_L6.7-W3.5-P2.30-BR
  rect 2.2x1.1 smd: 1(3.099,-2.3) 2(3.099,0) 3(3.099,2.3)
  rect 2.2x3.5 smd: 4(-3.099,0)
SW-TH_SHOU-HAN_SS12D10G4
  oval 1.7x2.9 hole 1.1x2.3: 1(-4.8,0) 2(0,0) 3(4.8,0)
TO-252-3_L6.5-W5.8-P4.58-BL
  rect 1.27x2.54 smd: 1(-2.288,-3.747) 3(2.288,-3.745)
  rect 5.4x6.1 smd: 2(-0.002,3.747)

## Nets
3V3: 1K#3.2 104#13.2 104#14.1 106#5.2 106#6.1 U1.4 U4.1 U4.20
5V: 1K#4.1 104#12.2 106#4.2 U1.3 U2.4
12V: 1K#2.1 10K.1 104#2.2 104#4.2 104#6.2 104#9.1 104#10.2 106#2.1 D1.1 D5_L1.2 D5_L2.2 D5_R1.2 D5_R2.2 U1_L1.1 U1_L1.3 U1_L2.1 U1_L2.3 U1_R1.1 U1_R1.3 U1_R2.1 U1_R2.3
GND: 0.2 1K.2 3V3.1 4.7K.1 5V.1 12V.1 104#2.1 104#4.1 104#6.1 104#8.1 104#9.2 104#10.1 104#11.1 104#12.1 104#13.1 104#14.2 106.1 106#2.2 106#3.1 106#4.1 106#5.1 106#6.2 H1.1 R8.1 R9.1 R10.1 U1.1 U1_L1.4 U1_L2.4 U1_R1.4 U1_R2.4 U2.1 U3.2 U4.6 U4.7 U4.8 U4.9 U4.10 U4.11 U4.12 U4.13 U4.14 U4.19
PGND: 0.1 C13.2 CN1.1 D4_L1.2 D4_L2.2 D4_R1.2 D4_R2.2 Q2_L1.3 Q2_L2.3 Q2_R1.3 Q2_R2.3
VBAT: 104#8.2 104#11.2 106.2 106#3.2 D3_L1.1 D3_L2.1 D3_R1.1 D3_R2.1 L1.2 Q1_L1.2 Q1_L2.2 Q1_R1.2 Q1_R2.2 U2.3 U3.4 U3.5 U5.2
ML+: 104#7.2 D3_L1.2 D4_L1.1 P1.2 Q1_L1.3 Q2_L1.2 U1_L1.6
ML-: 104.2 D3_R1.2 D4_R1.1 P1.1 Q1_R1.3 Q2_R1.2 U1_R1.6
MR+: 104#3.2 D3_L2.2 D4_L2.1 P2.2 Q1_L2.3 Q2_L2.2 U1_L2.6
MR-: 104#5.2 D3_R2.2 D4_R2.1 P2.1 Q1_R2.3 Q2_R2.2 U1_R2.6
PWM1: 4.7K.2 U1_L1.2 U4.15
PWM2: R8.2 U1_R1.2 U4.16
PWM3: R10.2 U1_L2.2 U4.17
PWM4: R9.2 U1_R2.2 U4.18
$1N995: D2_L1.2 Q2_L1.1 R2_L1.2
$1N996: D1_L1.1 NOREF.1 U1_L1.7
$1N997: D2_L1.1 R2_L1.1 U1_L1.5
$1N999: 104#7.1 D5_L1.1 U1_L1.8
$1N1006: D1_R1.1 R1_R1.1 U1_R1.7
$1N1007: D1_R1.2 Q1_R1.1 R1_R1.2
$1N1008: D2_R1.1 R2_R1.1 U1_R1.5
$1N1009: D2_R1.2 Q2_R1.1 R2_R1.2
$1N1011: 104.1 D5_R1.1 U1_R1.8
$1N1019: D1_L1.2 NOREF.2 Q1_L1.1
$1N2169: D2_L2.2 Q2_L2.1 R2_L2.2
$1N2170: D1_L2.1 R1_L2.1 U1_L2.7
$1N2171: D2_L2.1 R2_L2.1 U1_L2.5
$1N2173: 104#3.1 D5_L2.1 U1_L2.8
$1N2190: D1_R2.1 R1_R2.1 U1_R2.7
$1N2191: D1_R2.2 Q1_R2.1 R1_R2.2
$1N2192: D2_R2.1 R2_R2.1 U1_R2.5
$1N2193: D2_R2.2 Q2_R2.1 R2_R2.2
$1N2195: 104#5.1 D5_R2.1 U1_R2.8
$1N2213: D1_L2.2 Q1_L2.1 R1_L2.2
$1N2727: 1K#3.1 3V3.2
$1N2731: 1K#4.2 5V.2
$1N3245: D1.2 L1.1 U3.1
$1N3247: 9.1K.2 10K.2
$1N3248: 1K.1 9.1K.1 U3.3
$1N3249: 1K#2.2 12V.2
$1N4108: C13.1 CN1.2 U5.1
$1N4523: H1.2 U4.5
$1N4524: H1.3 U4.4
$1N4525: H1.4 U4.3
$1N4526: H1.5 U4.2

Pads without a net: U1 2; U2 2; U3 6; U5 3

## Via types
v1: diameter 0.61, hole 0.305, Top Layer to Bottom Layer, 180 vias

## Routing (per net, layer and track width the routed paths; a pad name or vN(x,y) marks a point on that pad's centre or on a via; arc(x,y) is an arc through that point)
3V3: length 29.2
  Bottom Layer w0.305: 42.63,24.77 106#5.2 ; 45.19,24.65 45.24,24.65 1K#3.2
  Bottom Layer w0.508: U1.4 45.35,28.95 45.35,24.81 45.19,24.65 ; 42.42,16.41 U4.1 ; 42.42,16.41 42.56,16.26 44.32,16.26 44.32,23.79 45.19,24.65 ; 42.42,16.41 U4.20 ; 45.19,24.65 106#5.2 104#13.2
5V: length 13.2
  Bottom Layer w0.508: 35.43,31.43 35.43,23.82 35.95,23.3 1K#4.1 ; 35.43,31.43 106#4.2 ; 35.43,31.43 104#12.2 37.26,31.38 U1.3
12V: length 111.5
  Top Layer w0.508: 54.89,29.93 54.67,30.14 104#4.2 54.8,32 57.41,32 D5_L2.2 ; 104#6.2 67.08,30.06 U1_R2.1 ; 12.47,30.03 104#10.2 14.28,31.77 14.38,31.88 ; 106#2.1 69.29,33.95 ; 104#9.1 69.12,36.74
  Top Layer w0.762: 54.67,30.14 53.89,30.14 53.09,29.34 53.09,28.45 54.1,27.43 54.93,27.43 ; 66.22,33.76 67.08,32.89 104#6.2 68.38,32.02 D5_R2.2 ; 66.22,33.76 54.48,33.76 54.67,33.56 104#4.2 ; 66.22,33.76 68.81,33.76 68.83,33.78 ; 12.47,27.49 11.12,27.49 10.67,27.94 10.67,29.46 11.23,30.03 12.47,30.03 ; U1_R2.3 65.7,27.39 65.02,28.07 65.02,29.34 65.61,29.93 U1_R2.1 ; 31.35,33.78 31.38,33.75 31.38,31.75 ; 31.35,33.78 13.33,33.78 12.47,32.91 104#10.2 ; 31.35,33.78 54.42,33.78 ; 104#9.1 D1.1 66.7,37.19 1K#2.1 65.15,39.25 10K.1 ; 31.38,31.75 31.38,29.82 U1_R1.1 30.61,29.59 30.1,29.08 30.1,27.56 30.61,27.05 U1_R1.3 ; 31.38,31.75 D5_R1.2 ; 69.12,36.74 69.12,33.83 106#2.1
GND: length 14.3
  Top Layer w0.305: 12.47,26.22 12.47,25.17 v1(12.45,25.15)
  Top Layer w0.508: v1(45.85,31.88) 53.27,31.88 104#4.1
  Bottom Layer w0.305: 24.26,24.24 U2.1
PGND:
  vias: v1(4.57,6.99) v1(4.57,5.84) v1(4.57,4.7) v1(5.54,6.99) v1(5.53,5.84) v1(5.53,4.7) v1(6.51,6.99) v1(6.51,5.84) v1(6.52,4.7) v1(23.21,6.86) v1(23.21,5.72) v1(23.21,4.57) v1(24.18,6.86) v1(24.17,5.72) v1(24.17,4.57) v1(25.15,6.86) v1(25.14,5.72) v1(25.15,4.57) v1(48.05,6.86) v1(48.05,5.72) v1(48.05,4.57) v1(49.02,6.86) v1(49.01,5.72) v1(49.01,4.57) v1(49.99,6.86) v1(49.98,5.72) v1(50,4.57) v1(72.69,6.73) v1(72.69,5.59) v1(72.69,4.45) v1(73.66,6.73) v1(73.65,5.59) v1(73.65,4.45) v1(74.62,5.59) v1(74.63,6.73) v1(74.63,4.45) v1(79.5,43.43) v1(79.5,42.55) v1(79.5,41.66) v1(79.5,40.77) v1(79.5,39.88) v1(79.5,38.99) v1(80.27,43.43) v1(80.27,42.55) v1(80.27,41.66) v1(80.27,40.77) v1(80.27,39.88) v1(80.27,38.99) v1(81.03,43.43) v1(81.03,42.55) v1(81.03,41.66) v1(81.03,40.77) v1(81.03,39.88) v1(81.03,38.99)
VBAT: length 19.5
  Top Layer w0.508: U3.4 U3.5 58.99,41.46 104#8.2 56.09,41.43 106.2
  Top Layer w0.762: 106.2 54.18,37.5 54.85,36.83
  Bottom Layer w0.508: Q1_R1.2 25.76,28.83 29.79,28.83 106#3.2 29.79,32.64
  vias: v1(6.67,29.46) v1(6.67,28.58) v1(6.67,27.56) v1(6.67,26.67) v1(7.81,29.46) v1(7.81,28.58) v1(7.81,27.56) v1(7.81,26.67) v1(9.08,29.46) v1(9.08,28.58) v1(9.08,27.56) v1(9.08,26.67) v1(24.07,29.37) v1(24.07,28.48) v1(24.07,27.46) v1(24.07,26.57) v1(25.21,29.37) v1(25.21,28.48) v1(25.21,27.46) v1(25.21,26.57) v1(26.48,29.37) v1(26.48,28.48) v1(26.48,27.46) v1(26.48,26.57) v1(48.79,29.55) v1(48.79,28.66) v1(48.79,27.65) v1(48.79,26.75) v1(49.93,29.55) v1(49.93,28.66) v1(49.93,27.65) v1(49.93,26.75) v1(51.2,29.55) v1(51.2,28.66) v1(51.2,27.65) v1(51.2,26.75) v1(53.85,37.08) v1(53.85,36.07) v1(54.86,37.08) v1(54.86,36.07) v1(76.01,28.77) v1(76.01,27.5) v1(76.01,26.35) v1(76.9,28.77) v1(76.9,27.5) v1(76.9,26.35)
ML+: length 31.8
  Top Layer w0.305: U1_L1.6 19.42,27.49 104#7.2 20.57,21.21 19.69,20.32 8.74,20.32 8.13,20.93
  Bottom Layer w2.54: Q2_L1.2 9.59,13.78 13.85,9.53
  vias: v1(6.48,15.24) v1(6.48,14.22) v1(6.48,13.21) v1(6.48,12.07) v1(7.68,15.24) v1(7.68,14.35) v1(7.68,13.21) v1(7.68,12.07) v1(8.89,15.24) v1(8.89,14.35) v1(8.89,13.21) v1(8.89,12.07)
ML-: length 24.8
  Top Layer w0.305: D3_R1.2 27.02,21.05 30.73,24.77 34.54,24.77 36.83,27.05 U1_R1.6
  Top Layer w0.508: U1_R1.6 39.2,27.05 104.2
  Bottom Layer w2.54: P1.1 v1(23.49,13.9) Q2_R1.2
  vias: v1(22.86,21.18) v1(22.86,19.3) v1(22.86,17.78) v1(22.99,16.26) v1(23.49,12.53) v1(24.13,21.18) v1(24.14,19.3) v1(24.13,17.78) v1(24.13,16.26) v1(25.08,13.9) v1(25.08,12.53) v1(25.3,21.18) v1(25.3,19.3) v1(25.27,17.78) v1(25.27,16.26) v1(26.67,13.9) v1(26.67,12.57)
MR+: length 32.1
  Top Layer w0.305: v1(58.67,24.77) 58.67,27.05 59.14,27.52 U1_L2.6
  Top Layer w0.508: U1_L2.6 61.48,27.52 104#3.2
  Bottom Layer w0.305: v1(58.67,24.77) 57.78,23.88 51.94,23.88 49.15,21.08
  Bottom Layer w2.54: P2.2 57.97,13.9 Q2_L2.2
  vias: v1(48.13,16) v1(48.13,14.86) v1(48.13,13.72) v1(48.13,12.45) v1(49.72,16) v1(49.72,14.73) v1(49.72,13.72) v1(49.72,12.45) v1(51.31,16) v1(51.31,14.86) v1(51.31,13.59) v1(51.31,12.45)
MR-: length 22
  Top Layer w0.305: 104#5.2 74.53,28.11 73.81,27.39 U1_R2.6 72.09,27.39 70.74,26.04 v1(70.74,22.23)
  Bottom Layer w0.305: v1(70.74,22.23) 70.74,21.97 72.05,20.66 Q1_R2.3
  Bottom Layer w2.54: P2.1 67.42,11.54 69.9,14.02 v1(73.96,14.02) 74.99,14.02
  vias: v1(73.91,15.37) v1(73.91,12.7) v1(73.91,11.43) v1(75.22,15.37) v1(75.26,14.02) v1(75.25,12.7) v1(75.25,11.43) v1(76.66,15.37) v1(76.7,14.02) v1(76.7,11.43) v1(76.74,12.7)
PWM1: length 36.3
  Top Layer w0.305: 12.47,28.76 14.42,28.76 14.99,28.19 v1(14.99,25.65) ; 4.7K.2 36.07,11.22 v1(36.07,13.59)
  Bottom Layer w0.305: v1(14.99,25.65) 19.3,25.65 22.35,22.61 31.24,22.61 36.07,17.78 U4.15 v1(36.07,13.59)
PWM2: length 20.5
  Top Layer w0.305: v1(37.34,13.59) 37.34,11.79 37.96,11.17 R8.2 ; U1_R1.2 32.72,28.32 33.4,27.64 v1(33.4,26.54)
  Bottom Layer w0.305: v1(33.4,26.54) 33.4,23.75 37.34,19.81 U4.16 v1(37.34,13.59)
PWM3: length 32.7
  Top Layer w0.305: v1(38.61,13.72) 38.61,12.57 40.05,11.13 R10.2 ; v1(39.75,19.43) 44.2,23.88 52.07,23.88 53.38,25.19 55.54,25.19 56.39,26.04 56.39,28.35 55.95,28.79 U1_L2.2
  Bottom Layer w0.305: v1(39.75,19.43) 38.61,18.29 U4.17 v1(38.61,13.72)
PWM4: length 44
  Top Layer w0.305: 42.16,11.43 41.91,11.43 39.88,13.46 v1(39.88,13.72) ; v1(40.51,19.05) 44.45,22.99 v1(53.59,22.99) ; U1_R2.2 67.73,28.66 68.45,27.94 68.45,25.65 v1(67.56,24.77)
  Top Layer w0.508: 42.16,11.43 R9.2
  Bottom Layer w0.305: v1(40.51,19.05) 39.88,18.42 U4.18 v1(39.88,13.72) ; v1(53.59,22.99) 65.79,22.99 v1(67.56,24.77)
$1N995: length 18.8
  Top Layer w0.305: 16.12,15.62 16.12,17.77 16.51,18.16 D2_L1.2 ; R2_L1.2 16.26,15.6 v1(16.26,9.27)
  Bottom Layer w0.305: 9.37,6.29 13.65,6.29 16.26,8.89 v1(16.26,9.27)
$1N996: length 11.4
  Top Layer w0.305: 16.12,23.1 NOREF.1 ; 16.12,23.1 16.12,28.06 16.76,28.7 18.21,28.7 U1_L1.7 ; 16.12,23.1 16.14,23.11 17.84,23.11 D1_L1.1
$1N997: length 15.2
  Top Layer w0.305: R2_L1.1 14.86,15.71 14.86,17.88 14.57,18.16 D2_L1.1 12.95,18.31 v1(12.95,19.56) ; 18.27,26.22 18.54,26.22 18.29,25.96 v1(18.29,24.89)
  Bottom Layer w0.305: v1(12.95,19.56) v1(18.29,24.89)
$1N999: length 4.3
  Top Layer w0.305: D5_L1.1 17.89,30.4 U1_L1.8 20.34,30.03 20.57,29.8
$1N1006: length 12.8
  Top Layer w0.305: v1(34.42,23.75) 33.4,22.73 D1_R1.1 33.53,20.79 R1_R1.1 ; U1_R1.7 36.58,28.32 v1(34.42,26.16)
  Bottom Layer w0.305: v1(34.42,26.16) v1(34.42,23.75)
$1N1007: length 11.9
  Top Layer w0.305: D1_R1.2 35.03,21.05 R1_R1.2 33.89,19.18 v1(30.86,19.18)
  Bottom Layer w0.305: v1(30.86,19.18) 30.69,19.18 29.21,20.66 27.37,20.66
$1N1008: length 13.3
  Top Layer w0.305: 35.05,15.24 35.05,15.86 D2_R1.1 37.08,17.53 38.86,19.3 38.86,24.89 37.97,25.78 U1_R1.5
$1N1009: length 16.1
  Top Layer w0.305: D2_R1.2 33.53,15.59 R2_R1.2 30.78,14.76 29.59,13.57 v1(29.59,11.56)
  Bottom Layer w0.305: v1(29.59,11.56) 29.59,8.62 27.37,6.4
$1N1011: length 5.1
  Top Layer w0.508: 104.1 39.16,29.59 U1_R1.8 37.41,30.83 D5_R1.1
$1N1019: length 7.8
  Top Layer w0.305: NOREF.2 14.61,22.15 13.65,23.11 13.22,23.11 D1_L1.2 12.95,23.37 v1(10.92,21.34)
  Bottom Layer w0.305: v1(10.92,21.34) 10.05,21.34 9.37,20.66
$1N2169: length 14.8
  Top Layer w0.305: R2_L2.2 57.66,15.33 57.66,13.08 v1(56.01,11.43)
  Top Layer w0.508: D2_L2.2 55.65,17.37 57.54,15.49 57.54,15.35
  Bottom Layer w0.305: v1(56.01,11.43) 52.28,7.7 52.28,6.4
$1N2170: length 14.4
  Top Layer w0.305: 59.95,23.62 58.43,23.62 57.28,24.77 57.28,28.19 57.87,28.79 U1_L2.7 ; 59.95,23.62 59.95,23.25 58.72,22.02 58.72,20.7 ; 59.95,23.62 D1_L2.1
$1N2171: length 13.9
  Top Layer w0.305: 60.68,26.12 61.26,26.12 62.86,24.51 62.86,19.56 61.47,18.16 D2_L2.1
  Top Layer w0.508: D2_L2.1 60.78,16.95 R2_L2.1
$1N2173: length 3.8
  Top Layer w0.305: D5_L2.1 60.8,30.11 U1_L2.8
  Top Layer w0.508: U1_L2.8 60.76,30.05 104#3.1
$1N2190: length 12.1
  Top Layer w0.305: U1_R2.7 71.75,28.66 69.6,26.51 69.6,25.08 D1_R2.1 69.29,20.69 R1_R2.1
$1N2191: length 12.1
  Top Layer w0.305: 72.39,24 v1(72.38,23.99) D1_R2.2 72.38,22.05 70.8,20.48 R1_R2.2
  Bottom Layer w0.305: Q1_R2.1 77.28,23.05 76.2,24.13 72.52,24.13 v1(72.38,23.99)
$1N2192: length 17.3
  Top Layer w0.305: D2_R2.1 72.19,17.19 70.34,15.35 ; U1_R2.5 74.04,24.83 74.04,16.76 72.62,15.35 70.34,15.35 ; 70.34,15.35 R2_R2.1
$1N2193: length 17.6
  Top Layer w0.305: v1(74.93,9.91) 71.12,9.91 68.79,12.24 R2_R2.2 68.73,15.35 67.05,17.02 D2_R2.2
  Bottom Layer w0.305: v1(74.93,9.91) 77.28,7.56 Q2_R2.1
$1N2195: length 4.5
  Top Layer w0.305: 74.91,29.89 74.87,29.93 U1_R2.8 72.75,31.04 D5_R2.1
$1N2213: length 8.3
  Top Layer w0.305: R1_L2.2 57.21,22.31 55.9,23.62 D1_L2.2 55.35,23.5 55.24,23.5 v1(53.72,21.97)
  Bottom Layer w0.305: 52.28,20.66 52.41,20.66 v1(53.72,21.97)
$1N2727: length 1.9
  Bottom Layer w0.508: 1K#3.1 45.35,23.24 45.35,21.38 45.35,21.37
$1N2731: length 2
  Bottom Layer w0.508: 5V.2 39.36,22.75 1K#4.2
$1N3245: length 6.7
  Top Layer w0.762: 58.95,36.83 D1.2 61.35,37.42 61.35,40.26
$1N3247: length 1.9
  Top Layer w0.762: 10K.2 65.11,42.42 9.1K.2
$1N3248: length 4
  Top Layer w0.508: 63.4,42.48 9.1K.1
  Top Layer w0.762: 1K.1 63.4,40.87 63.4,42.48 U3.3
$1N3249: length 1.8
  Top Layer w0.762: 12V.2 1K#2.2
$1N4523: length 3.4
  Bottom Layer w0.305: U4.5 37.34,5.84 36.32,4.83
$1N4524: length 3.2
  Bottom Layer w0.305: U4.4 38.61,5.33 39.12,4.83
$1N4525: length 3.8
  Bottom Layer w0.305: 41.4,4.57 39.88,6.1 U4.3
$1N4526: length 4.2
  Bottom Layer w0.305: U4.2 41.15,7.11 43.69,4.57

## Copper pours and planes (outline as drawn; the poured copper is in the pictures)
GND on Top Layer: -2.29,56.64 88.14,56.64 88.14,-4.95 -2.29,-4.95
GND on Bottom Layer: -0.64,57.79 90.8,57.79 90.8,-6.48 -0.64,-6.48
PGND on Top Layer: 46.77,43.8 80.91,43.8 80.91,2.33 46.77,2.33
PGND on Top Layer: 4.06,44.45 48.06,44.45 48.06,3.89 4.06,3.89
PGND on Bottom Layer: 46.86,7.62 50.8,7.62 50.8,3.94 46.86,3.94
PGND on Bottom Layer: 40.86,43.82 81.53,43.82 81.53,38.39 40.86,38.39
PGND on Bottom Layer: 21.97,8.13 26.16,8.13 26.16,3.56 21.97,3.56
PGND on Bottom Layer: 71.63,7.75 76.33,7.75 76.33,3.68 71.63,3.68
PGND on Bottom Layer: 4.19,8 8.25,8 8.25,4.19 4.19,4.19
VBAT on Top Layer: 6.73,31.24 9.24,31.24 9.24,24.71 6.73,24.71
VBAT on Top Layer: 23.75,31.37 26.89,31.37 26.89,25.29 23.75,25.29
VBAT on Top Layer: 48.39,30.61 50.99,30.61 50.99,24.96 48.39,24.96
VBAT on Top Layer: 76.01,29.97 78.11,29.97 78.11,25.02 76.01,25.02
VBAT on Bottom Layer: 4.37,44.05 78.61,44.05 78.61,24.26 4.37,24.26
ML+ on Top Layer: 6.32,21.97 8.6,21.97 8.6,10.8 6.32,10.8
ML+ on Bottom Layer: 4.06,21.84 8.24,21.84 8.24,10.8 4.06,10.8
ML- on Top Layer: 22.35,22.1 26.34,22.1 26.34,10.92 22.35,10.92
ML- on Bottom Layer: 22.22,21.84 26.29,21.84 26.29,11.17 22.22,11.17
MR+ on Top Layer: 47.18,22.14 50.83,22.14 50.83,10.92 47.18,10.92
MR+ on Bottom Layer: 47.12,21.84 50.83,21.84 50.83,10.74 47.12,10.74
MR- on Top Layer: 72.14,22.1 76.46,22.1 76.46,10.9 72.14,10.9
MR- on Bottom Layer: 72.14,22.1 75.31,22.1 75.31,10.93 72.14,10.93
$1N4108 on Top Layer: 15.56,44.41 40.01,44.41 40.01,38.6 15.56,38.6

Small or netless copper shapes (teardrops, artwork), in the pictures only: 124 on Top Layer, 72 on Bottom Layer

## Text on the board
Bottom Layer: 广东工业大学 / 共用电子队 / 2024
Top Silkscreen Layer: GND | PWM1->4 | 电源开关 | ——>
